# Altium project button.PrjPcb
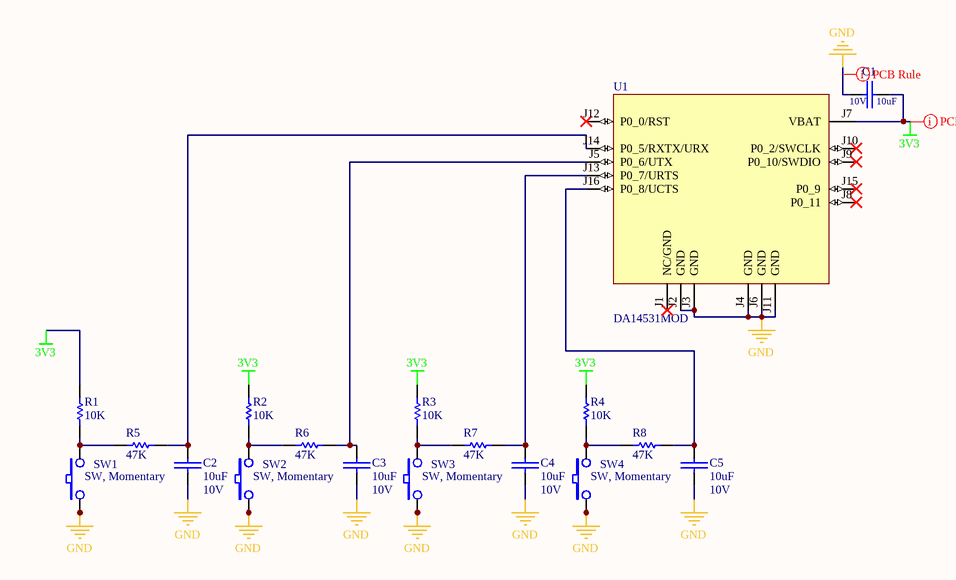
[diagram p0: button.SchDoc]
1 sheet, 18 parts. Net scope: global (net labels, ports and power ports of the same name join across sheets).
Board file: button.PcbDoc

## Sheet button.SchDoc
size A4; SheetNumber: 1; SheetTotal: 1

### Parts
C1  10uF  Voltage Rating: 10V  [CAPC1608X10N]
C2  10uF  Voltage Rating: 10V  [CAPC1608X10N]
C3  10uF  Voltage Rating: 10V  [CAPC1608X10N]
C4  10uF  Voltage Rating: 10V  [CAPC1608X10N]
C5  10uF  Voltage Rating: 10V  [CAPC1608X10N]
R1  10K  [RESC1608X06N]
R2  10K  [RESC1608X06N]
R3  10K  [RESC1608X06N]
R4  10K  [RESC1608X06N]
R5  47K  [RESC1608X06N]
R6  47K  [RESC1608X06N]
R7  47K  [RESC1608X06N]
R8  47K  [RESC1608X06N]
SW1  SW, Momentary  [SW_PTS810]
SW2  SW, Momentary  [SW_PTS810]
SW3  SW, Momentary  [SW_PTS810]
SW4  SW, Momentary  [SW_PTS810]
U1  DA14531MOD  [DLG_DA14531MOD-00F01002]

### Nets
3V3: C1.1 R1.1 R2.1 R3.1 R4.1 U1.J7(VBAT)
GND: C1.2 C2.2 C3.2 C4.2 C5.2 SW1.1 SW1.2 SW2.1 SW2.2 SW3.1 SW3.2 SW4.1 SW4.2 U1.J2(GND) U1.J3(GND) U1.J4(GND) U1.J6(GND) U1.J11(GND)
NetC2_1: C2.1 R5.2 U1.J14(P0_5/RXTX/URX)
NetC3_1: C3.1 R6.2 U1.J5(P0_6/UTX)
NetC4_1: C4.1 R7.2 U1.J13(P0_7/URTS)
NetC5_1: C5.1 R8.2 U1.J16(P0_8/UCTS)
NetR1_2: R1.2 R5.1 SW1.3 SW1.4
NetR2_2: R2.2 R6.1 SW2.3 SW2.4
NetR3_2: R3.2 R7.1 SW3.3 SW3.4
NetR4_2: R4.2 R8.1 SW4.3 SW4.4

Not connected (* = marked no-connect by the designer): U1 J1(NC/GND)* J8(P0_11)* J9(P0_10/SWDIO)* J10(P0_2/SWCLK)* J12(P0_0/RST)* J15(P0_9)*

### Layout directives
rule Width Constraint [Pref Width = 50mil    Min Width = 30mil    Max Width = 100mil]; net class Power: 3V3, GND

### Library data of the parts
C1-C5 = CI-10uF-10V-X5R-SR-MRT: Capacitor, 10uF, 10V, SM; Manufacturer's Part #: GRM188R61A106KE69D; Manufacturer: Murata; Detailed Description: Capacitor, 10uF, 10V, SM 0603, Multilayer Ceramic, X5R, RoHS; Tolerance: 10%; Part: 10uF; Type: Capacitor; Revision: 1; Supplier 1: Digi-Key; Supplier 2: Mouser; Supplier Part Number 1: 490-10474-1-ND; Supplier Part Number 2: 81-GRM188R61A106KE9D; Package: 0603
R1-R4 = RP-10K-SR-KOA: Resistor, 10K ohms, 1/8W, 1%, SM; Manufacturer's Part #: RK73H1JTTD1002F; Manufacturer: KOA Speer; Detailed Description: Resistor, 10K ohms, 1/8W, 1%, 100 ppm, SM, 75 WV, 100 OV, Thick Film, 0603, RoHS; Voltage Rating: 75V; Part: 10K; Type: Resistor; Revision: 1; Power Rating: 1/8W; Tolerance: 1%; Resistance: 10K; Package: 0603; Supplier 1: Digi-Key; Supplier 2: Mouser; Supplier 3: Arrow Electronics; Supplier Part Number 1: 2019-RK73H1JTTD1002FCT-ND; Supplier Part Number 2: 660-RK73H1JTTD1002F; Supplier Part Number 3: RK73H1JTTD1002F; Value: 10K
R5-R8 = RP-47K-SR-KOA: Resistor, 47K ohms, 1/8W, 1%, SM; Manufacturer's Part #: RK73H1JTTD6802F; Manufacturer: KOA Speer; Detailed Description: Resistor, 47K ohms, 1/8W, 1%, 100 ppm, SM, 75 WV, 100 OV, Thick Film, 0603, RoHS; Voltage Rating: 75V; Part: 47K; Type: Resistor; Revision: 1; Power Rating: 1/8W; Tolerance: 1%; Resistance: 47K; Package: 0603; Supplier 1: Digi-Key; Supplier 2: Mouser; Supplier 3: Arrow Electronics; Supplier Part Number 1: 2019-RK73H1JTTD6802FCT-ND; Supplier Part Number 2: 660-RK73H1JTTD6802F; Supplier Part Number 3: RK73H1JTTD6802F; Value: 47K
SW1-SW4 = SW-PTS810SJG250-SR-CKC: Switch, Pushbutton, Top Actuated, SM; Manufacturer's Part #: PTS810 SJG 250 SMTR LFS; Manufacturer: C&K Components; Detailed Description: Switch, Pushbutton, Top Actuated, SM, RoHS; Part: SW, Momentary; Type: Switch, Pushbutton; Revision: 1; Supplier 1: Digi-Key; Supplier 2: Newark; Supplier Part Number 1: CKN10504CT-ND; Supplier Part Number 2: 35AH5293
U1 = UD-DA14531MOD-00F01002-SR-DLG: DA14531MOD, Bluetooth Low Energy 5.1 Module, SM; Manufacturer 1: Renesas Electronics; Detailed Description: DA14531MOD, Bluetooth Low Energy 5.1 Module, 128 kB Flash, 144kB ROM, 48kB RAM, 16-SMD Module, SM, RoHS; Manufacturer Part Number 1: DA14531MOD-00F01002; Part: DA14531MOD; Type: BLE 5.1 Module; Revision: 1; Package: 16-SMD Module; Supplier 1: Digi-Key; Supplier 2: Mouser; Supplier Part Number 1: 1695-DA14531MOD-00F01002CT-ND; Supplier Part Number 2: 724-DA14531MODF01002